# Altium schematic sheet AS7263.SchDoc: TITLE
size 282 x 200 mm; Date: DATE; SheetNumber: 1; COMPANY: >COMPANY; DRAWN: DRAWN; REV: REV; DRG: DRG; o: o; N: N; 2015: 2015; C: C; ISSUE: ISSUE; CHECKED: CHECKED; FILE:: FILE:; PAGE:: PAGE:; >DRGNO: >DRGNO
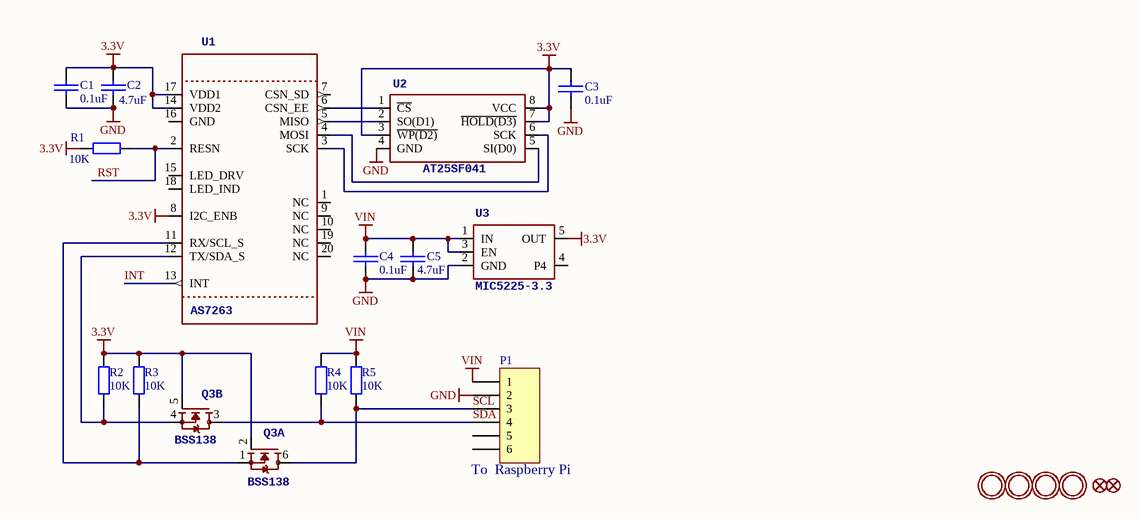
[diagram p0: AS7263.SchDoc]

## Parts
C1  0.1uF  [0805]
C2  4.7uF  [0805]
C3  0.1uF  [0805]
C4  0.1uF  [0805]
C5  4.7uF  [0805]
FID2  FIDUCIAL_1MM  [FIDUCIAL_1MM]  (value not drawn)
FID3  FIDUCIAL_1MM  [FIDUCIAL_1MM]  (value not drawn)
P1  To  Raspberry Pi  [HDR1X6]
Q3  BSS138  [SOT363]  (parts A,B of 2)
R1  10K  [0805]
R2  10K  [0805]
R3  10K  [0805]
R4  10K  [0805]
R5  10K  [0805]
U1  AS7263  [AS726X_LGA20]
U2  AT25SF041  [SO08]
U3  MIC5225-3.3  [SOT23-5]
U$2  MOUNTINGHOLE2.5  [MOUNTINGHOLE_2.5_PLATED]  (value not drawn)
U$3  MOUNTINGHOLE2.5  [MOUNTINGHOLE_2.5_PLATED]  (value not drawn)
U$22  MOUNTINGHOLE2.5  [MOUNTINGHOLE_2.5_PLATED]  (value not drawn)
U$23  MOUNTINGHOLE2.5  [MOUNTINGHOLE_2.5_PLATED]  (value not drawn)

## Nets
3.3V: C1.1 C2.1 C3.1 Q3.2(G) Q3.5(G) R1.2 R2.1 R3.1 U1.8(I2C_ENB) U1.14(VDD2) U1.17(VDD1) U2.3(~{WP(D2)}) U2.7(~{HOLD(D3)}) U2.8(VCC) U3.5(OUT)
GND: C1.2 C2.2 C3.2 C4.2 C5.2 P1.2 U2.4(GND) U3.2(GND)
VIN: C4.1 C5.1 P1.1 R4.1 R5.1 U3.1(IN) U3.3(EN)
INT: U1.13(INT)
RST: R1.1 U1.2(RESN)
SCL: P1.3 Q3.6(D) R5.2
SDA: P1.4 Q3.3(D) R4.2
NetQ3_1: Q3.1(S) R3.2 U1.11(RX/SCL_S)
NetQ3_4: Q3.4(S) R2.2 U1.12(TX/SDA_S)
NetU1_3: U1.3(SCK) U2.6(SCK)
NetU1_4: U1.4(MOSI) U2.5(SI(D0))
NetU1_5: U1.5(MISO) U2.2(SO(D1))
NetU1_6: U1.6(CSN_EE) U2.1(~{CS})

Not connected (* = marked no-connect by the designer): P1 5 6; U1 1(NC) 7(CSN_SD) 9(NC) 10(NC) 15(LED_DRV) 16(GND) 18(LED_IND) 19(NC) 20(NC); U3 4(P4)

## Notes on the sheet
- 1
- 2
- 3
- 4
- 5
- 6
- A
- B
- C
- D

## Library data of the parts
C1-C5 = CAP
FID2 FID3 = FIDUCIAL_1MM: <b>Fiducial Alignment Points</b> / <p>Various fiducial points for machine vision alignment.</p>; BOM: EXCLUDE
P1 = Header 6: Header, 6-Pin; LatestRevisionDate: 17-Jul-2002; LatestRevisionNote: Re-released for DXP Platform.; Publisher: Altium Limited
Q3 = MOSFET-N_DUAL: <b>Dual N-Channel MOSFET</b> / <p><b>SOT363</b> (2.0x1.25mm)</p> / <ul> / <li>2N7002PS - 60V, 320mA [Digikey: 568-5984-1-ND]</li> / </ul>; D: D; S: S; G: G
R1-R5 = Res2: Resistor; Value: 1K; Published: 8-Jun-2000; LatestRevisionDate: 17-Jul-2002; LatestRevisionNote: Re-released for DXP Platform.; PackageReference: AXIAL-0.4; Publisher: Altium Limited; PackageDescription: Axial Device, Thru-Hole; 2 Leads; 0.4 in Pin Spacing
U1 = AS726X_SPECTRAL: <p><b>AS726x Spectral Sensor</b></p>; AS726x
U2 = AT25SF041: <h3>AT25SF041 4Mb Serial Flash Memory</h3> / <p>104MHz, SPI, 8-SOIC / <li><a href=”http://www.adestotech.com/wp-content/uploads/DS-AT25SF041_044.pdf”>Datasheet</a></li></p> / <p><b>SparkFun Products:</b> / <ul><li><a href=”https://www.sparkfun.com/products/13231”>SparkFun ESP8266 Thing</a></li> / <li><a href=”https://www.sparkfun.com/products/13711”>SparkFun ESP8266 Thing - Dev Board</a></li> / </ul></p>
U3 = VREG_SOT23-5: <p><b>SOT23-5 Fixed Voltage Regulators</b></p> / <p></p> / <table width="700"> / <tr bgcolor="#EEEEEE" > / <td><b>Part</b></td> / <td><b>Current Out</b></td> / <td><b>V Out</b></td> / <td><b>V In</b></td> / <td><b>V Dropout</b></td> / <td><b>θJA (°C/W)</b></td> / <td><b>TJ (°C)</b></td> / <td><b>Digikey Part No.</b></td> / </tr> / <tr> / <td>ADP121</td> / <td>150mA</td> / <td><b>3.3V</b></td> / <td>3.4-5.5V</td> / <td>0.09V @ 150mA</td> / <td>--</td> / <td>--</td> / <td>ADP121-AUJZ33R7CT-ND</td> / </tr> / <tr> / <td>ADP121</td> / <td>150mA</td> / <td><b>3.0V</b></td> / <td>3.1-5.5V</td> / <td>0.09V @ 150mA</td> / <td>--</td> / <td>--</td> / <td>ADP121-AUJZ30R7CT-ND</td> / </tr> / <tr> / <td>ADP122</td> / <td><strong>300mA</strong></td> / <td><b>3.3V</b></td> / <td>3.4-5.5V</td> / <td>0.085V @ 300mA</td> / <td>--</td> / <td>--</td> / <td>ADP122AUJZ-3.3-R7CT-ND</td> / </tr> / <tr> / <td>ADP1712</td> / <td><strong>300mA</strong></td> / <td><b>3.3V</b></td> / <td>3.5-5.5V</td> / <td>0.17V @ 300mA</td> / <td>--</td> / <td>--</td> / <td>ADP1712AUJZ-3.3-R7TR-ND</td> / </tr> / <tr> / <td>AP7311 (<b>Low Cost</b>)</td> / <td>150mA</td> / <td><b>3.3V</b></td> / <td>3.5-6V</td> / <td>0.15V @ 150mA</td> / <td>--</td> / <td>--</td> / <td>AP7311-33WG-7DICT-ND</td> / </tr> / <tr> / <td>LD39015M18R</td> / <td>150mA</td> / <td><b>1.8V</b></td> / <td>1.9V-5.5V</td> / <td>0.08V @ 100mA</td> / <td>--</td> / <td>--</td> / <td>497-6977-1-ND</td> / </tr> / <tr> / <td>LP2985A-33DBVR</td> / <td>150mA</td> / <td><b>3.3V</b></td> / <td>3.3-16V</td> / <td>0.28V @ 150mA</td> / <td>206</td> / <td>150</td> / <td>296-18479-1-ND</td> / </tr> / <tr> / <td>MCP1824T-3302E/OT</td> / <td><b>300mA</b></td> / <td><b>3.3V</b></td> / <td>3.5V-6V</td> / <td>0.2V @ 300mA</td> / <td>--</td> / <td>--</td> / <td>MCP1824T-3302E/OTCT-ND</td> / </tr> / <tr> / <td>MIC5205-2.5YM5 TR</td> / <td>150mA</td> / <td><b>2.5V</b></td> / <td>2.7-16V</td> / <td>0.165V @ 150mA</td> / <td>--</td> / <td>--</td> / <td>576-1257-2-ND</td> / </tr> / <tr> / <td>MIC5205-3.0YM5 TR</td> / <td>150mA</td> / <td><b>3.0V</b></td> / <td>3.2V-16V</td> / <td>0.165V @ 150mA</td> / <td>--</td> / <td>--</td> / <td>576-1258-2-ND</td> / </tr> / <tr> / <td>MIC5205-3.3YM5 TR</td> / <td>150mA</td> / <td><b>3.3V</b></td> / <td>3.5V-16V</td> / <td>0.165V @ 150mA</td> / <td>--</td> / <td>--</td> / <td>576-1259-2-ND</td> / </tr> / <tr> / <td>TPS780330220</td> / <td>150mA</td> / <td><b>3.3V+2.2V</b></td> / <td>3.6-5.5V</td> / <td>250mV Max</td> / <td>--</td> / <td>--</td> / <td>296-23332-1-ND</td> / </tr> / <tr> / <td>TDA3663/N1,135</td> / <td>100mA</td> / <td><b>3.3V</b></td> / <td>3.5-<b>45V</b></td> / <td>0.18V @ 50mA</td> / <td>--</td> / <td>--</td> / <td>568-5343-1-ND</td> / </tr> / <tr> / <td></td> / <td></td> / <td></td> / <td></td> / <td></td> / <td></td> / <td></td> / <td></td> / </tr> / <tr> / <td></td> / <td></td> / <td></td> / <td></td> / <td></td> / <td></td> / <td></td> / <td></td> / </tr> / </table> / <p>Max operating temp can be calculated using θJA, TJ (max junction temperature), and power in watts.  Set the "Maximum Ambient Temperature" until it reaches TJ ("Max Junction Temperature"), which is the absolute limit for safe use of the regulator: <a href="http://www.daycounter.com/Calculators/Heat-Sink-Temperature-Calculator.phtml">Heat Sink Temperature Calculator</a></p> / <p>For example, With 12V source into a 3.3V LP2985 and a 30mA load, we are dissipating (12V-3.3V) * 0.03A = 0.261W.  With a θJA of 206 °C/W, a TJ of 150°C, and 261mW we can safely use the chip without a heat sink up to 75°C (=147.1°C Junction Temperature).</p>
U$2 U$3 U$22 U$23 = MOUNTINGHOLE2.5: <b>Mounting Hole</b> / <p>For #2 screws (0.086"/2.18mm width, 0.094"/2.4mm hole) use 2.5mm</p>; BOM: EXCLUDE